# EAGLE board pandashield12-lga (EAGLE 6.0), part 1 of 2
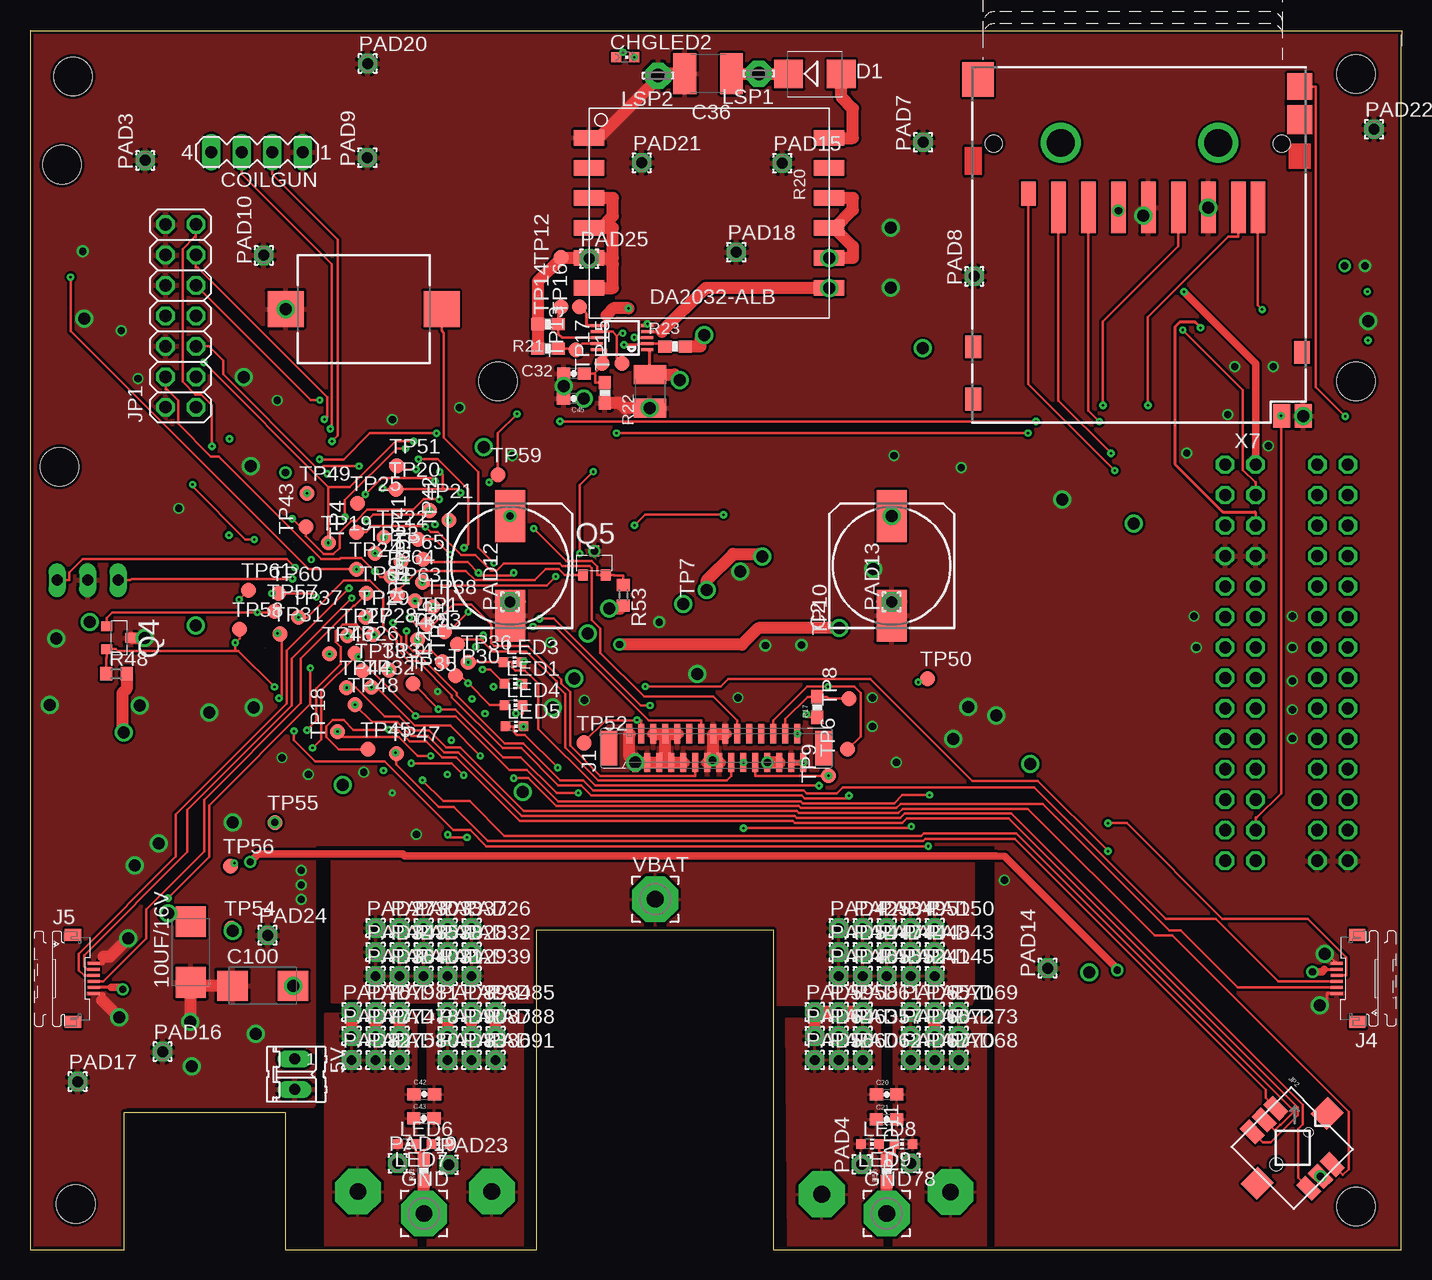
[diagram p9: board, top side]
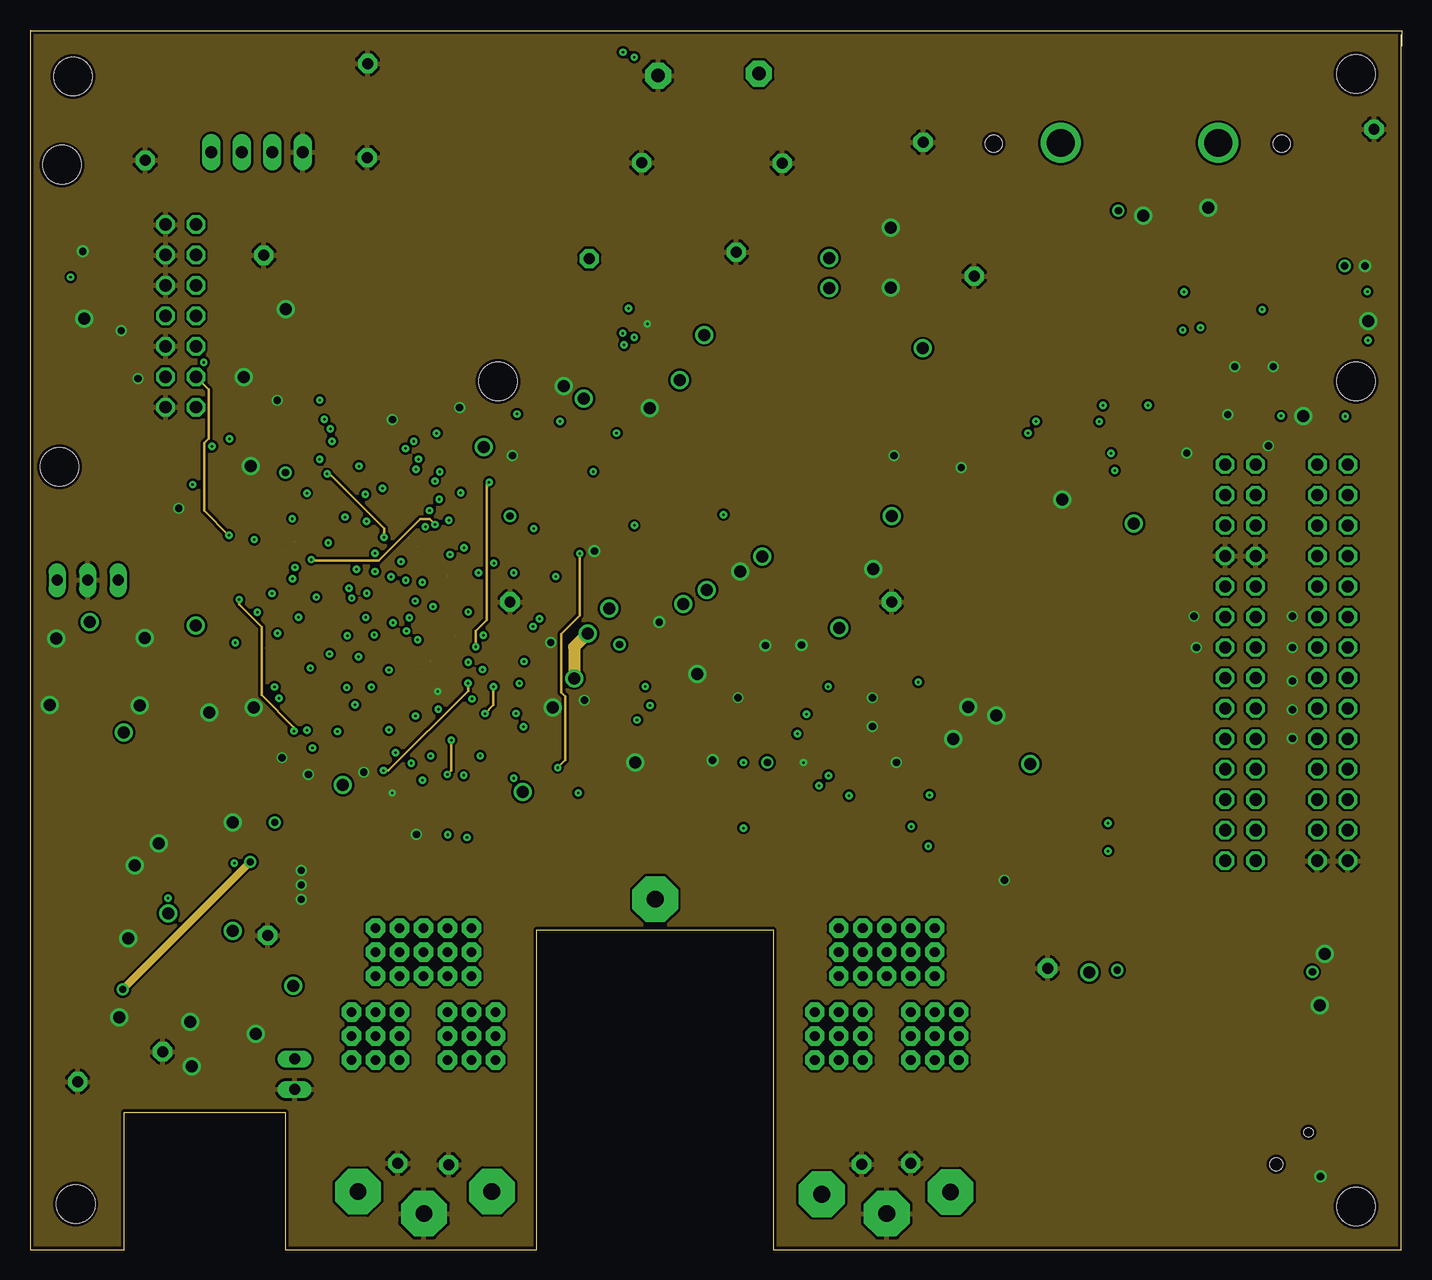
[diagram p10: board, inner layer Route2]
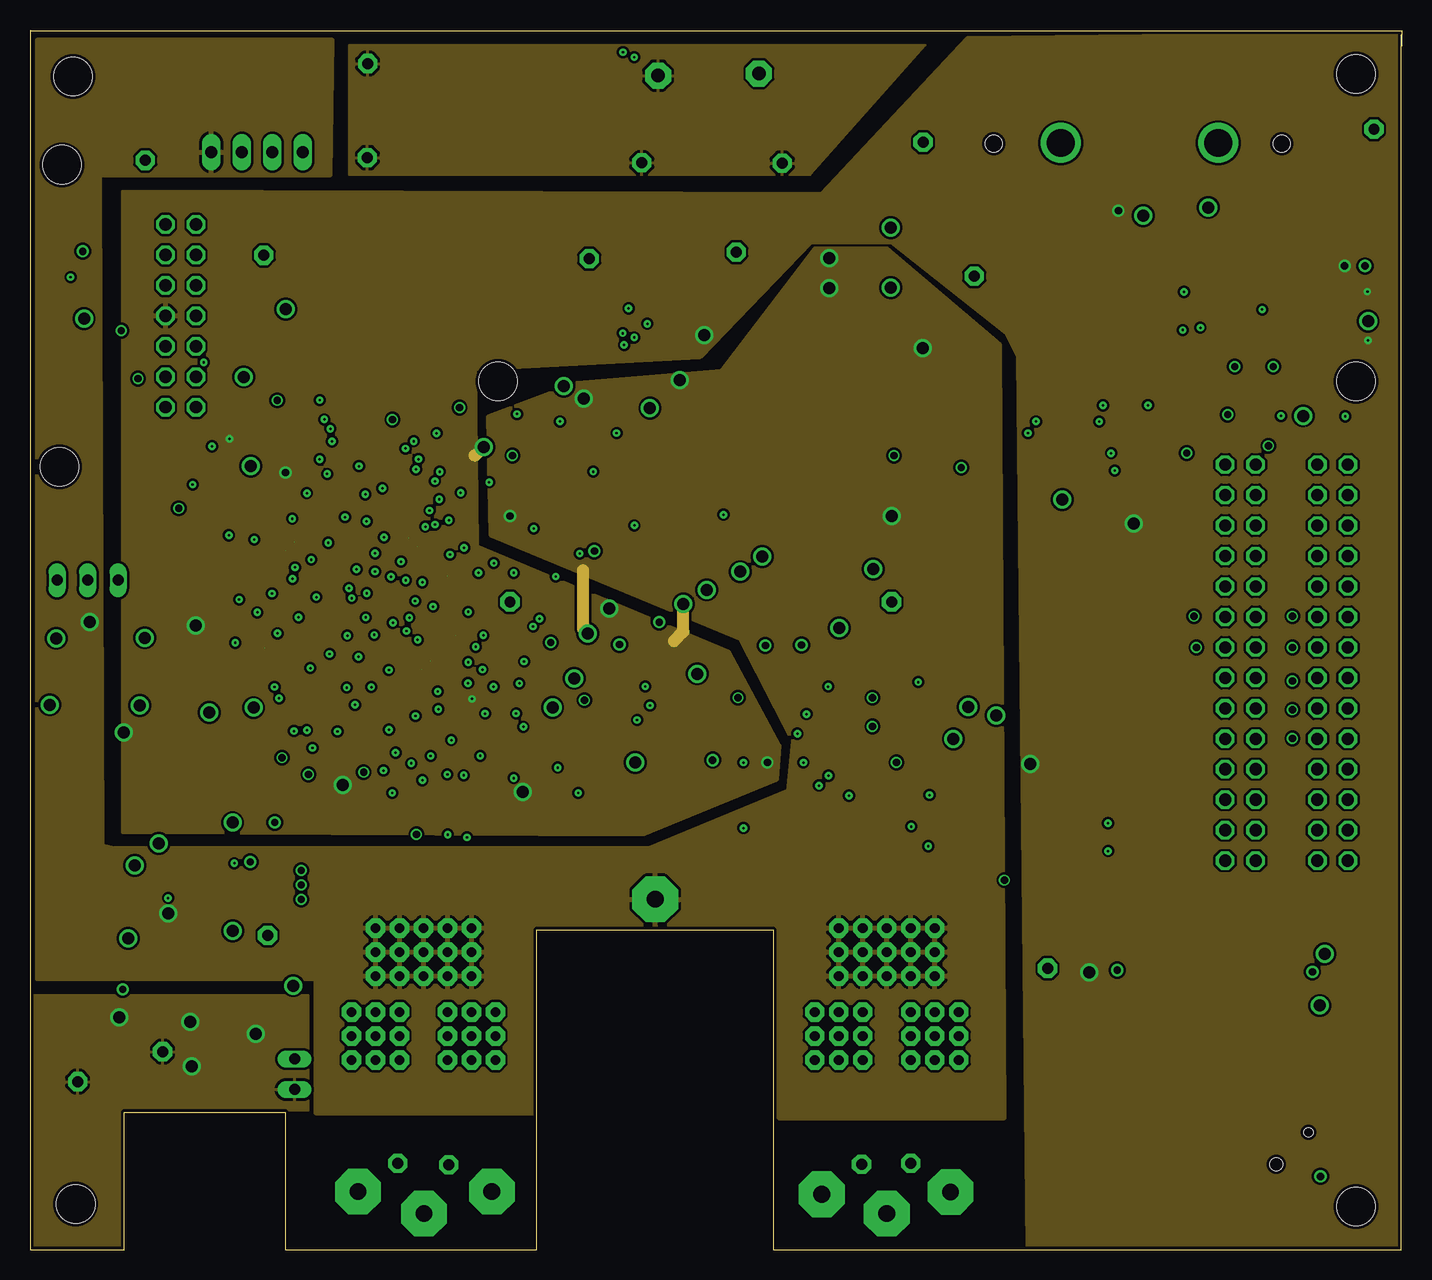
[diagram p11: board, inner layer Route15]
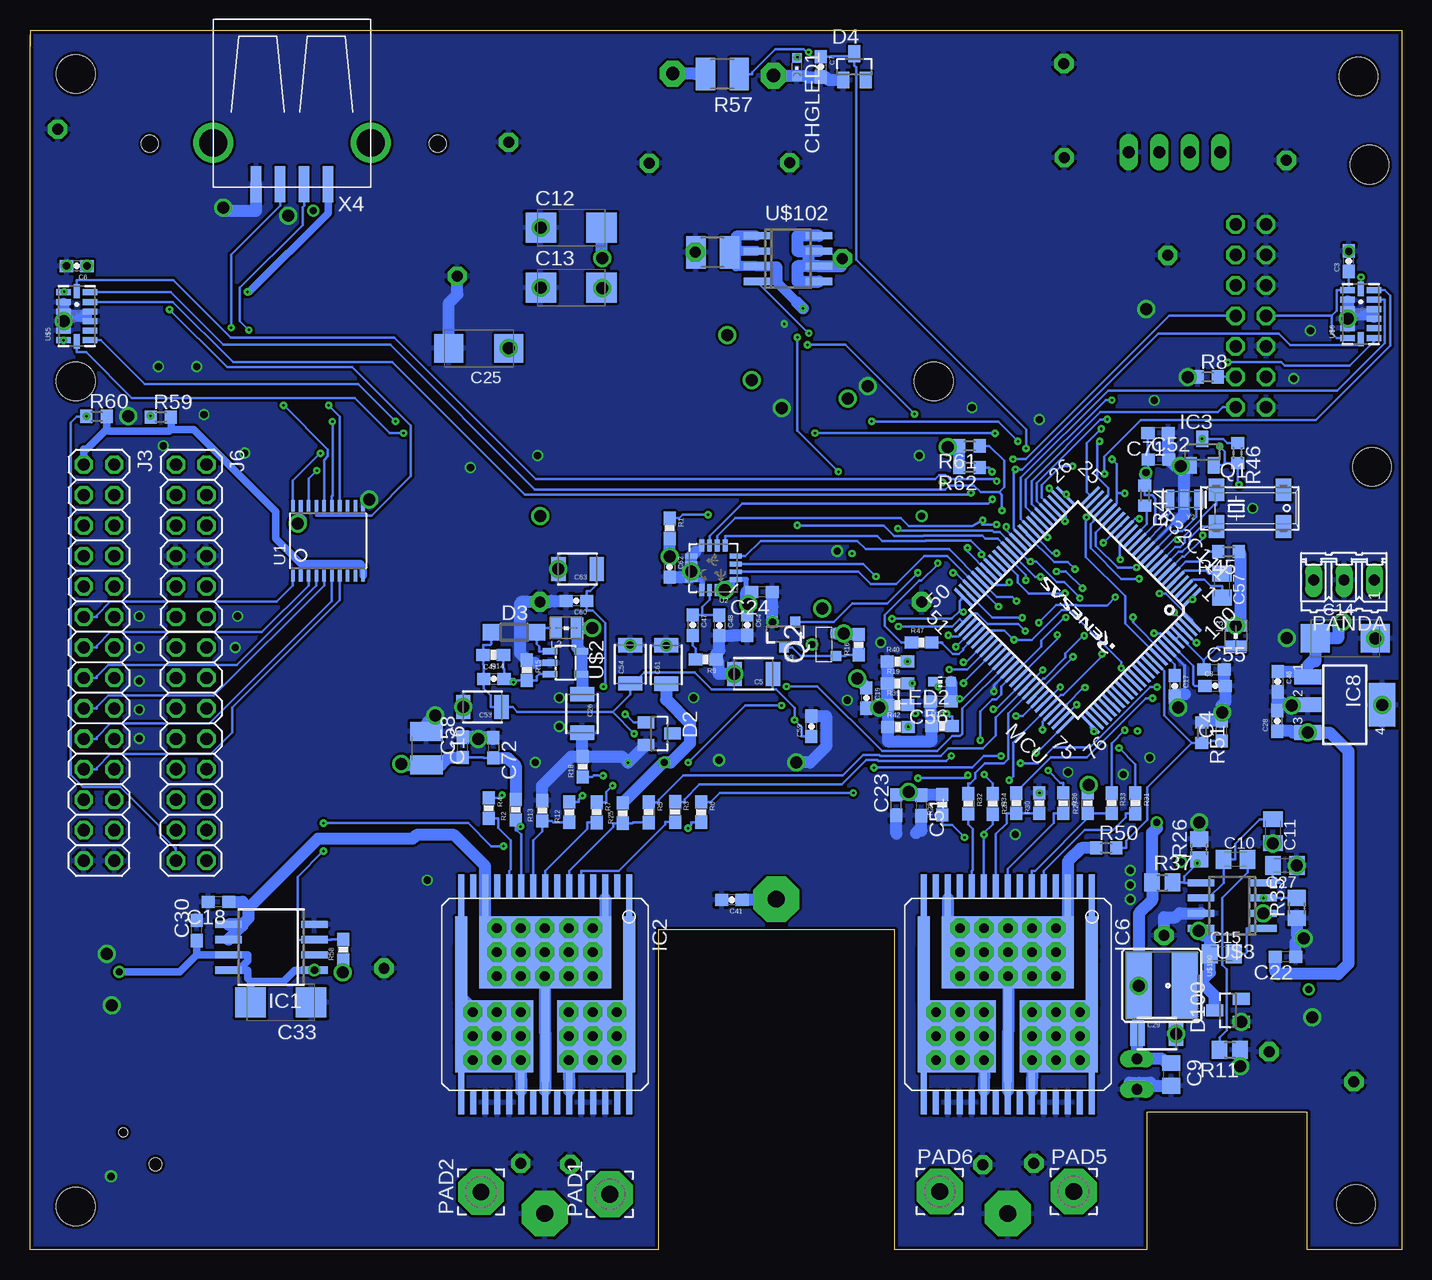
[diagram p12: board, bottom side, seen from below]

Size 114.3 x 101.67 mm. Coordinates in mm from the lower left corner, seen from the top.
Outline: 114.28,101.27 114.28,0 80.6,0 80.4,0 79.6,0 61.94,0 61.94,26.67 42.22,26.67 42.22,0 24.4,0 24.2,0 21.25,0 21.25,11.43 7.85,11.43 7.85,0 0,0 0,101.6
Outline: 0,101.67 0,101.6
Outline: 0,101.6 74.6,101.6 114.3,101.6 114.3,100.33
Copper layers (1*2+15*16): Top 0.035mm / dielectric 1.5mm / Route2 0.035mm / dielectric 0.15mm / Route15 0.035mm / dielectric 0.2mm / Bottom 0.035mm
Design rules: minimum track width 6mil, minimum drill 12mil, track to track 6mil, track to pad 6mil, pad to pad 6mil, via to via 6mil, smd to smd 0mil, copper to edge 10mil, drill to drill 10mil, minimum pad ring 10mil, minimum via ring 6mil, stop-mask expansion 2mil, vias tented up to drill 100mil, thermal gap 10mil
Net classes: 0 default: width 0.203 mm, drill 0.152 mm, clearance 0.203 mm; 1 power: width 0.635 mm, drill 0.305 mm, clearance 0.203 mm; 2 morepower: width 1.016 mm, drill 0.508 mm, clearance 0.203 mm
Holes 3.2 mm at 3.81,3.81 110.49,3.59 110.49,98.01 3.59,97.79 110.49,72.39 38.99,72.39 2.45,65.26 2.67,90.44

## Footprints (pad centres in the part's own frame; a part is rotated, then mirrored left to right if it is on the bottom)
02P = drill 0.914 long: 1 -1.27,0; 2 1.27,0
C/6032-28R = smd 2.55 x 2.5: + 2.525,0; - -2.525,0
153CLV-1014 = smd 4.3 x 2.5: + 4.15,0; - -4.15,0
0603-CAP = smd 1.1 x 1: 1 -0.85,0; 2 0.85,0
C0603 = smd 1.1 x 1: 1 -0.85,0; 2 0.85,0
1210 = smd 1.2 x 2: 1 -1.6,0; 2 1.6,0
C0805 = smd 1.3 x 1.5: 1 -0.95,0; 2 0.95,0
C0805K = smd 1.3 x 1.6: 1 -1,0; 2 1,0
SMC_C = smd 2.4 x 2.4: + -2.5,0; - 2.5,0
C1210 = smd 1.6 x 2.7: 1 -1.4,0; 2 1.4,0
C1812 = smd 1.9 x 3.4: 1 -1.95,0; 2 1.95,0
CHIPLED_0603 = smd 0.8 x 0.8: A 0,-0.75; C 0,0.75
MA04-1 = drill 1.016 long: 1 -3.81,0; 2 -1.27,0; 3 1.27,0; 4 3.81,0
SMB = smd 2.4 x 2.4: A 2.2,0; C -2.2,0
SOT23 = smd 1 x 1.4: 1 -0.95,-1.1; 2 0.95,-1.1; 3 0,1.1
SOD123 = smd 1.4 x 1.4: A 1.9,0; C -1.9,0
3,81/1,4 = drill 1.397 pad 3.81 octagon: 1 0,0
SOP-08 = smd 0.6 x 2.2: 1 -1.905,-3.6; 2 -0.635,-3.6; 3 0.635,-3.6; 4 1.905,-3.6; 5 1.905,3.575; 6 0.635,3.575; 7 -0.635,3.575; 8 -1.905,3.575
MULTIPOWERSO-30 = smd 0.508 x 12: 1 -7,-4; 15 7,-4; 16 7,4; 30 -7,4 | smd 0.508 x 2: 2 -6,-9; 4 -4,-9; 5 -3,-9; 6 -2,-9; 7 -1,-9; 8 0,-9; 9 1,-9; 10 2,-9; 11 3,-9; 12 4,-9; 14 6,-9; 17 6,9; 18 5,9; 19 4,9; 20 3,9; 22 1,9; 24 -1,9; 26 -3,9; 27 -4,9; 28 -5,9; 29 -6,9 | smd 0.508 x 4: 3 -5,-8; 13 5,-8; 21 2,8; 23 0,8; 25 -2,8 | smd 6.5 x 6: OUTA -4.25,3.5; OUTB 4.25,3.5 | smd 1 x 7.5: OUTA@1 -7,-2.755; OUTB@1 7,-2.755 | smd 11 x 6: VCC 0,-3.5 | smd 0.65 x 8.3: VCC@1 0,3.145
SOT23B-3 = smd 1 x 1.4: 1 -0.95,-1.1; 2 0.95,-1.1; 3 0,1.1
SOT223 = smd 1.219 x 2.235: 1 -2.311,-3.099; 2 0,-3.099; 3 2.311,-3.099 | smd 3.6 x 2.2: 4 0,3.099
XF2J-3024-11 = smd 1.6 x 0.5: 1 1.2,7.25; 2 -1.2,6.75; 3 1.2,6.25; 4 -1.2,5.75; 5 1.2,5.25; 6 -1.2,4.75; 7 1.2,4.25; 8 -1.2,3.75; 9 1.2,3.25; 10 -1.2,2.75; 11 1.2,2.25; 12 -1.2,1.75; 13 1.2,1.25; 14 -1.2,0.75; 15 1.2,0.25; 16 -1.2,-0.25; 17 1.2,-0.75; 18 -1.2,-1.25; 19 1.2,-1.75; 20 -1.2,-2.25; 21 1.2,-2.75; 22 -1.2,-3.25; 23 1.2,-3.75; 24 -1.2,-4.25; 25 1.2,-4.75; 26 -1.2,-5.25; 27 1.2,-5.75; 28 -1.2,-6.25; 29 1.2,-6.75; 30 -1.2,-7.25 | smd 2.9 x 1.4: M1 0,8.95; M2 0,-8.95
2X14 = drill 1.016 octagon: 1 -16.51,-1.27; 2 -16.51,1.27; 3 -13.97,-1.27; 4 -13.97,1.27; 5 -11.43,-1.27; 6 -11.43,1.27; 7 -8.89,-1.27; 8 -8.89,1.27; 9 -6.35,-1.27; 10 -6.35,1.27; 11 -3.81,-1.27; 12 -3.81,1.27; 13 -1.27,-1.27; 14 -1.27,1.27; 15 1.27,-1.27; 16 1.27,1.27; 17 3.81,-1.27; 18 3.81,1.27; 19 6.35,-1.27; 20 6.35,1.27; 21 8.89,-1.27; 22 8.89,1.27; 23 11.43,-1.27; 24 11.43,1.27; 25 13.97,-1.27; 26 13.97,1.27; 27 16.51,-1.27; 28 16.51,1.27
XF2L-0625-1 = smd 1 x 0.25: 1 1.905,1.25; 2 1.905,0.75; 3 1.905,0.25; 4 1.905,-0.25; 5 1.905,-0.75; 6 1.905,-1.25 | smd 1.34 x 1: M1 0.18,3.638; M2 0.18,-3.638
2X07 = drill 1.016 octagon: 1 -7.62,-1.27; 2 -7.62,1.27; 3 -5.08,-1.27; 4 -5.08,1.27; 5 -2.54,-1.27; 6 -2.54,1.27; 7 0,-1.27; 8 0,1.27; 9 2.54,-1.27; 10 2.54,1.27; 11 5.08,-1.27; 12 5.08,1.27; 13 7.62,-1.27; 14 7.62,1.27
JOYSTICK_MINI = smd 1.85 x 1.1: A 0,2.8; B 6.65,2.8; C 0,0; CTR 0,1.4; D 6.65,0; GND 6.65,1.4 | smd 1.9 x 2: NC 3.325,5.53; NC@0 3.33,-2.72 | hole 0.75: 3.34,3.295 | hole 1.05: 3.325,-0.5
WE-KI_0805_B = smd 1.02 x 1.78: 1 -0.89,0; 2 0.89,0
CHIP-LED0603 = smd 0.8 x 0.8: A 0,-0.75; C 0,0.75
LSP11 = drill 1.118 pad 2.159 octagon: MP 0,0
MSOP = smd 0.25 x 1: 1 -1,-2.113; 2 -0.5,-2.113; 3 0,-2.113; 4 0.5,-2.113; 5 1,-2.113; 6 1,2.113; 7 0.5,2.113; 8 0,2.113; 9 -0.5,2.113; 10 -1,2.113
100P6Q-A = smd 0.25 x 2: 1 -6,-7.5; 2 -5.5,-7.5; 3 -5,-7.5; 4 -4.5,-7.5; 5 -4,-7.5; 6 -3.5,-7.5; 7 -3,-7.5; 8 -2.5,-7.5; 9 -2,-7.5; 10 -1.5,-7.5; 11 -1,-7.5; 12 -0.5,-7.5; 13 0,-7.5; 14 0.5,-7.5; 15 1,-7.5; 16 1.5,-7.5; 17 2,-7.5; 18 2.5,-7.5; 19 3,-7.5; 20 3.5,-7.5; 21 4,-7.5; 22 4.5,-7.5; 23 5,-7.5; 24 5.5,-7.5; 25 6,-7.5; 51 6,7.5; 52 5.5,7.5; 53 5,7.5; 54 4.5,7.5; 55 4,7.5; 56 3.5,7.5; 57 3,7.5; 58 2.5,7.5; 59 2,7.5; 60 1.5,7.5; 61 1,7.5; 62 0.5,7.5; 63 0,7.5; 64 -0.5,7.5; 65 -1,7.5; 66 -1.5,7.5; 67 -2,7.5; 68 -2.5,7.5; 69 -3,7.5; 70 -3.5,7.5; 71 -4,7.5; 72 -4.5,7.5; 73 -5,7.5; 74 -5.5,7.5; 75 -6,7.5 | smd 2 x 0.25: 26 7.5,-6; 27 7.5,-5.5; 28 7.5,-5; 29 7.5,-4.5; 30 7.5,-4; 31 7.5,-3.5; 32 7.5,-3; 33 7.5,-2.5; 34 7.5,-2; 35 7.5,-1.5; 36 7.5,-1; 37 7.5,-0.5; 38 7.5,0; 39 7.5,0.5; 40 7.5,1; 41 7.5,1.5; 42 7.5,2; 43 7.5,2.5; 44 7.5,3; 45 7.5,3.5; 46 7.5,4; 47 7.5,4.5; 48 7.5,5; 49 7.5,5.5; 50 7.5,6; 76 -7.5,6; 77 -7.5,5.5; 78 -7.5,5; 79 -7.5,4.5; 80 -7.5,4; 81 -7.5,3.5; 82 -7.5,3; 83 -7.5,2.5; 84 -7.5,2; 85 -7.5,1.5; 86 -7.5,1; 87 -7.5,0.5; 88 -7.5,0; 89 -7.5,-0.5; 90 -7.5,-1; 91 -7.5,-1.5; 92 -7.5,-2; 93 -7.5,-2.5; 94 -7.5,-3; 95 -7.5,-3.5; 96 -7.5,-4; 97 -7.5,-4.5; 98 -7.5,-5; 99 -7.5,-5.5; 100 -7.5,-6
1,6/0,9 = drill 0.914 pad 1.6 octagon: 1 0,0
1,6/0,8 = drill 0.813 pad 1.6 octagon: 1 0,0
03P = drill 0.914 long: 1 -2.54,0; 2 0,0; 3 2.54,0
MM20SS = smd 1.27 x 1.88: 1 -2.794,-1.524; 2 2.794,-1.524; 3 2.794,1.524; 4 -2.794,1.524
MICRO3 = smd 0.8 x 0.9: 1 -0.95,-1; 2 0.95,-1; 3 0,1
SOT23-3 = smd 0.8 x 0.9: 1 -0.95,-1; 2 0.95,-1; 3 0,1.1
0603-RES = smd 1.1 x 1: 1 -0.85,0; 2 0.85,0
R0603 = smd 1 x 1.1: 1 -0.85,0; 2 0.85,0
R0805 = smd 1.3 x 1.5: 1 -0.85,0; 2 0.85,0
R1210 = smd 1.6 x 2.7: 1 -1.4,0; 2 1.4,0
BUZZER-CMT1102 = smd 3 x 3: 1 -6.5,0; 2 6.5,0
B1,27 = smd 1.27 x 1.27: TP 0,0
TSSOP20 = smd 0.305 x 0.991: 1 -2.925,-2.918; 2 -2.275,-2.918; 3 -1.625,-2.918; 4 -0.975,-2.918; 5 -0.325,-2.918; 6 0.325,-2.918; 7 0.975,-2.918; 8 1.625,-2.918; 9 2.275,-2.918; 10 2.925,-2.918; 11 2.925,2.918; 12 2.275,2.918; 13 1.625,2.918; 14 0.975,2.918; 15 0.325,2.918; 16 -0.325,2.918; 17 -0.975,2.918; 18 -1.625,2.918; 19 -2.275,2.918; 20 -2.925,2.918
LGA16-4X4 = smd 1 x 0.4: 1 -1.85,0.975; 2 -1.85,0.325; 3 -1.85,-0.325; 4 -1.85,-0.975; 9 1.85,-0.975; 10 1.85,-0.325; 11 1.85,0.325; 12 1.85,0.975 | smd 0.4 x 1: 5 -0.975,-1.85; 6 -0.325,-1.85; 7 0.325,-1.85; 8 0.975,-1.85; 13 0.975,1.85; 14 0.325,1.85; 15 -0.325,1.85; 16 -0.975,1.85
DA2032-ALB = smd 2.54 x 1.27: 1 -10,6.27; 2 -10,3.77; 3 -10,1.27; 4 -10,-1.23; 5 -10,-3.73; 6 -10,-6.23; 7 10,-6.23; 8 10,-3.73; 9 10,-1.23; 10 10,1.27; 11 10,3.77; 12 10,6.27
SOT23-DBV = smd 0.55 x 1.2: 1 -0.95,-1.3; 2 0,-1.3; 3 0.95,-1.3; 4 0.95,1.3; 5 -0.95,1.3
SO8 = smd 0.6 x 2.2: 1 -1.905,-2.6; 2 -0.635,-2.6; 3 0.635,-2.6; 4 1.905,-2.6; 5 1.905,2.6; 6 0.635,2.6; 7 -0.635,2.6; 8 -1.905,2.6
LGA14 = smd 0.5 x 1.2: 1 2,1.1; 2 1.2,1.1; 3 0.4,1.1; 4 -0.4,1.1; 5 -1.2,1.1; 6 -2,1.1; 8 -2,-1.1; 9 -1.2,-1.1; 10 -0.4,-1.1; 11 0.4,-1.1; 12 1.2,-1.1; 13 2,-1.1 | smd 1.2 x 0.5: 7 -2.1,0; 14 2.1,0
CR54 = smd 5.5 x 2.15: P$1 0,1.92; P$2 0,-1.92
USB-A-S = smd 3 x 0.9: D+ 3.45,-1; D- 3.45,1; GND 3.45,-3; VBUS 3.45,3 | drill 2.311: P$5 0,-6.566; P$6 0,6.566
SDBMF-009XXBXX2 = smd 1.2 x 4.3: 1 6.7,5.325; 2 4.2,5.325; 3 1.7,5.325; 4 -0.8,5.325; 5 -3.3,5.325; 6 -5.8,5.325; 7 -8.3,5.325; 8 -9.925,5.325 | smd 1.2 x 2: 9 9.2,4.175 | smd 2.1 x 2.4: M1 -13.4,-2 | smd 2.6 x 2.9: M2 13.4,-5.35 | smd 1.3 x 1.9: M3 -13.6,17.4; M4 13.8,16.95; M5 13.8,21.3 | smd 1.4 x 1.95: SW1 -11.9,22.7; SW3 -13.7,22.7 | smd 2.1 x 2.2: SW2 -13.4,-4.75 | hole 1.4: -11.9,0; 12.1,0
RESONATOR-SMD = smd 0.7 x 1.7: 1 -1.2,0; 2 0,0; 3 1.2,0

## Placement (x,y rotation side)
5V  [02P]  22.05,14.61 270 top
10UF/16V  [C/6032-28R]  13.4,24.8 90 top
C1  820uF/16V  [153CLV-1014]  40,57 90 top
C2  820uF/16V  [153CLV-1014]  71.8,57 90 top
C3  0.1  [0603-CAP]  4.4,82.4 90 bottom
C4  33nF  [C0603]  15.01,43.24 90 bottom
C5  10uF  [1210]  54,48 180 bottom
C6  0.1  [0603-CAP]  110.4,82 180 bottom
C7  33n  [0603-CAP]  48.4,98.6 270 bottom
C8  33nF  [0603-CAP]  15.54,47 0 bottom
C9  4,7uF/6.3V  [C0805]  19.2,14.6 270 bottom
C10  180pF  [C0805K]  13.83,32.53 0 bottom
C11  12pF  [C0805K]  10.72,34.87 270 bottom
C12  100uF/16V  [C/6032-28R]  69.2,85.2 0 bottom
C13  100uF/16V  [C/6032-28R]  69.2,80.2 0 bottom
C14  22,0  [SMC_C]  4.69,50.96 0 bottom
C15  0.1  [C0805K]  14.99,24.66 0 bottom
C16  10,0  [C1210]  81.26,41.79 270 bottom
C17  33nF  [0603-CAP]  18.9,47 270 bottom
C18  0.1  [C0603]  98.6,29 180 bottom
C19  0,1  [0603-CAP]  44.6,45.98 270 bottom
C20  0,1  [0603-CAP]  71.38,12.93 0 top
C21  0,22  [0603-CAP]  71.38,10.86 0 top
C22  0,1  [C0603]  9.68,24.4 180 bottom
C23  0,1  [C0603]  42.1,37.06 90 bottom
C24  10n  [C0603]  53.3,54.83 180 bottom
C25  22,0  [SMC_C]  76.9,75.13 180 bottom
C26  10,0  [1210]  68.3,44.68 270 bottom
C27  15nF  [C0805K]  9.73,32.03 180 bottom
C28  0.1  [0603-CAP]  10.36,44.07 90 bottom
C29  10uF/6.3V  [1210]  20.4,18 0 bottom
C30  0.1  [C0603]  100.4,26.6 90 bottom
C31  10u  [C1210]  51.67,71.54 270 top
C32  100p  [0603-CAP]  45.33,73.02 180 top
C33  10uF/6.3V  [C/6032-28R]  93.4,20.6 180 bottom
C36  0.1uF 600V  [C1812]  56.52,98.03 180 top
C41  0,1  [0603-CAP]  55.81,29.15 180 bottom
C42  0,1  [0603-CAP]  32.85,12.96 0 top
C43  0,22  [0603-CAP]  32.82,10.93 0 top
C45  0.1  [0603-CAP]  45.32,70.94 180 top
C46  1uF  [0603-CAP]  10.32,47.35 270 bottom
C47  470nF  [0603-CAP]  59.07,52.05 270 bottom
C48  10nF  [0603-CAP]  56.85,52.04 270 bottom
C49  100p  [0603-CAP]  75.65,47.58 0 bottom
C51  0,1  [C0603]  40.03,37.03 270 bottom
C52  0,1  [C0603]  20.26,65.87 0 bottom
C53  10uF  [1210]  76.59,45.24 180 bottom
C54  10uF  [1210]  64.29,48.79 90 bottom
C55  0,1  [C0603]  15.62,48.35 0 bottom
C56  0,1  [C0603]  38.41,45.71 180 bottom
C57  4,7uF  [C0805K]  14.96,55.36 270 bottom
C58  0,1  [C0603]  78.23,41.86 90 bottom
C59  0.1  [0603-CAP]  49.18,43.62 90 bottom
C60  0.1  [0603-CAP]  68.76,54.08 180 bottom
C61  10uF  [1210]  61.28,48.76 90 bottom
C62  0.1  [0603-CAP]  61.01,56.91 270 bottom
C63  10uF  [1210]  68.67,56.73 180 bottom
C64  0.1  [0603-CAP]  54.52,52.07 270 bottom
C71  0,1  [C0603]  20.29,68.06 180 bottom
C72  0,1  [C0603]  75.68,41.82 270 bottom
C100  47uF/16V  [C/6032-28R]  19.4,22 0 top
CHGLED1  [CHIPLED_0603]  50.4,98.6 180 bottom
CHGLED2  [CHIPLED_0603]  49.6,99.4 270 top
COILGUN  [MA04-1]  18.92,91.49 180 top
D1  MURS160  [SMB]  65.41,98.01 0 top
D2  BAS70-04  [SOT23]  61.87,43.01 270 bottom
D3  MBR0530  [SOD123]  73.96,51.47 0 bottom
D4  BAT54  [SOT23]  45.6,98.6 0 bottom
D100  BAT54  [SOT23]  14.47,19.94 90 bottom
GND  [3,81/1,4]  32.83,3 0 top
GND78  [3,81/1,4]  71.4,3 0 top
IC1  TPS77350  [SOP-08]  94.2,25.2 90 bottom
IC2  VNH2SP30TR-E  [MULTIPOWERSO-30]  71.37,21.26 180 bottom
IC3  MAX803T  [SOT23B-3]  16.62,66.48 0 bottom
IC6  VNH2SP30TR-E  [MULTIPOWERSO-30]  32.81,21.27 180 bottom
IC8  LM2936MP-3.3  [SOT223]  4.73,45.42 270 bottom
J1  XF2J-3024-11  [XF2J-3024-11]  57.2,41.8 90 top
J3  [2X14]  108.55,48.93 270 bottom
J4  XF2L-0625-1  [XF2L-0625-1]  110.8,22.6 180 top
J5  XF2L-0625-1  [XF2L-0625-1]  3.4,22.6 0 top
J6  [2X14]  100.86,48.93 270 bottom
JP1  [2X07]  12.56,77.84 90 top
JP2  JOYSTICK_MINI4UCON  [JOYSTICK_MINI]  101.85,9.81 315 top
L2  10uH  [WE-KI_0805_B]  69.6,51.8 0 bottom
L3  4,7uH  [WE-KI_0805_B]  13.82,51.14 270 bottom
LED1  [CHIP-LED0603]  40.29,47.18 270 top
LED2  [CHIP-LED0603]  38.3,47.33 90 bottom
LED3  [CHIP-LED0603]  40.22,48.98 270 top
LED4  [CHIP-LED0603]  40.3,45.39 270 top
LED5  [CHIP-LED0603]  40.36,43.62 270 top
LED6  [CHIP-LED0603]  31.4,8.8 270 top
LED7  [CHIP-LED0603]  34.2,8.8 90 top
LED8  [CHIP-LED0603]  70,8.8 270 top
LED9  [CHIP-LED0603]  72.8,8.8 90 top
LSP1  LSP11  [LSP11]  60.74,98.03 180 top
LSP2  LSP11  [LSP11]  52.34,97.86 180 top
LT3750  LT3750  [MSOP]  49.33,76.01 90 top
MCU  R32C111  [100P6Q-A]  26.98,53.32 135 bottom
PAD1  [3,81/1,4]  65.99,4.61 90 bottom
PAD2  [3,81/1,4]  76.72,4.8 90 bottom
PAD3  [1,6/0,9]  9.6,90.8 90 top
PAD4  [1,6/0,9]  69.3,7.12 90 top
PAD5  [3,81/1,4]  27.33,4.83 0 bottom
PAD6  [3,81/1,4]  38.49,4.83 0 bottom
PAD7  [1,6/0,9]  74.42,92.31 90 top
PAD8  [1,6/0,9]  78.69,81.14 90 top
PAD9  [1,6/0,9]  28.12,91.03 90 top
PAD10  [1,6/0,9]  19.49,82.89 90 top
PAD11  [1,6/0,9]  73.4,7.2 90 top
PAD12  [1,6/0,9]  40,54 90 top
PAD13  [1,6/0,9]  71.8,54 90 top
PAD14  [1,6/0,9]  84.8,23.46 90 top
PAD15  [1,6/0,9]  62.68,90.57 0 top
PAD16  [1,6/0,9]  11.05,16.5 0 top
PAD17  [1,6/0,9]  3.97,14 0 top
PAD18  [1,6/0,9]  58.86,83.15 0 top
PAD19  [1,6/0,9]  30.64,7.19 0 top
PAD20  [1,6/0,9]  28.13,98.88 0 top
PAD21  [1,6/0,9]  50.98,90.6 0 top
PAD22  [1,6/0,9]  112,93.4 0 top
PAD23  [1,6/0,9]  34.9,7.06 0 top
PAD24  [1,6/0,9]  19.8,26.2 0 top
PAD25  [1,6/0,9]  46.6,82.6 0 top
PAD26  WIREPAD1,6/0,8  [1,6/0,8]  36.8,26.8 0 top
PAD27  WIREPAD1,6/0,8  [1,6/0,8]  28.8,26.8 0 top
PAD28  WIREPAD1,6/0,8  [1,6/0,8]  34.8,24.8 0 top
PAD29  WIREPAD1,6/0,8  [1,6/0,8]  34.8,22.8 0 top
PAD30  WIREPAD1,6/0,8  [1,6/0,8]  30.8,26.8 0 top
PAD31  WIREPAD1,6/0,8  [1,6/0,8]  32.8,22.8 0 top
PAD32  WIREPAD1,6/0,8  [1,6/0,8]  36.8,24.8 0 top
PAD33  WIREPAD1,6/0,8  [1,6/0,8]  32.8,26.8 0 top
PAD34  WIREPAD1,6/0,8  [1,6/0,8]  28.8,24.8 0 top
PAD35  WIREPAD1,6/0,8  [1,6/0,8]  30.8,24.8 0 top
PAD36  WIREPAD1,6/0,8  [1,6/0,8]  28.8,22.8 0 top
PAD37  WIREPAD1,6/0,8  [1,6/0,8]  34.8,26.8 0 top
PAD38  WIREPAD1,6/0,8  [1,6/0,8]  32.8,24.8 0 top
PAD39  WIREPAD1,6/0,8  [1,6/0,8]  36.8,22.8 0 top
PAD40  WIREPAD1,6/0,8  [1,6/0,8]  30.8,22.8 0 top
PAD41  WIREPAD1,6/0,8  [1,6/0,8]  73.4,22.8 0 top
PAD42  WIREPAD1,6/0,8  [1,6/0,8]  67.4,26.8 0 top
PAD43  WIREPAD1,6/0,8  [1,6/0,8]  75.4,24.8 0 top
PAD44  WIREPAD1,6/0,8  [1,6/0,8]  71.4,24.8 0 top
PAD45  WIREPAD1,6/0,8  [1,6/0,8]  75.4,22.8 0 top
PAD46  WIREPAD1,6/0,8  [1,6/0,8]  67.4,22.8 0 top
PAD47  WIREPAD1,6/0,8  [1,6/0,8]  69.4,24.8 0 top
PAD48  WIREPAD1,6/0,8  [1,6/0,8]  73.4,24.8 0 top
PAD49  WIREPAD1,6/0,8  [1,6/0,8]  71.4,26.8 0 top
PAD50  WIREPAD1,6/0,8  [1,6/0,8]  75.4,26.8 0 top
PAD51  WIREPAD1,6/0,8  [1,6/0,8]  73.4,26.8 0 top
PAD52  WIREPAD1,6/0,8  [1,6/0,8]  71.4,22.8 0 top
PAD53  WIREPAD1,6/0,8  [1,6/0,8]  69.4,26.8 0 top
PAD54  WIREPAD1,6/0,8  [1,6/0,8]  67.4,24.8 0 top
PAD55  WIREPAD1,6/0,8  [1,6/0,8]  69.4,22.8 0 top
PAD56  WIREPAD1,6/0,8  [1,6/0,8]  65.4,15.8 0 top
PAD57  WIREPAD1,6/0,8  [1,6/0,8]  69.4,17.8 0 top
PAD58  WIREPAD1,6/0,8  [1,6/0,8]  67.4,19.8 0 top
PAD59  WIREPAD1,6/0,8  [1,6/0,8]  65.4,19.8 0 top
PAD60  WIREPAD1,6/0,8  [1,6/0,8]  67.4,15.8 0 top
PAD61  WIREPAD1,6/0,8  [1,6/0,8]  69.4,19.8 0 top
PAD62  WIREPAD1,6/0,8  [1,6/0,8]  69.4,15.8 0 top
PAD63  WIREPAD1,6/0,8  [1,6/0,8]  67.4,17.8 0 top
PAD64  WIREPAD1,6/0,8  [1,6/0,8]  65.4,17.8 0 top
PAD65  WIREPAD1,6/0,8  [1,6/0,8]  73.4,19.8 0 top
PAD66  WIREPAD1,6/0,8  [1,6/0,8]  73.4,17.8 0 top
PAD67  WIREPAD1,6/0,8  [1,6/0,8]  73.4,15.8 0 top
PAD68  WIREPAD1,6/0,8  [1,6/0,8]  77.4,15.8 0 top
PAD69  WIREPAD1,6/0,8  [1,6/0,8]  77.4,19.8 0 top
PAD70  WIREPAD1,6/0,8  [1,6/0,8]  75.4,15.8 0 top
PAD71  WIREPAD1,6/0,8  [1,6/0,8]  75.4,19.8 0 top
PAD72  WIREPAD1,6/0,8  [1,6/0,8]  75.4,17.8 0 top
PAD73  WIREPAD1,6/0,8  [1,6/0,8]  77.4,17.8 0 top
PAD74  WIREPAD1,6/0,8  [1,6/0,8]  28.8,17.8 0 top
PAD75  WIREPAD1,6/0,8  [1,6/0,8]  28.8,15.8 0 top
PAD76  WIREPAD1,6/0,8  [1,6/0,8]  26.8,19.8 0 top
PAD77  WIREPAD1,6/0,8  [1,6/0,8]  26.8,17.8 0 top
PAD78  WIREPAD1,6/0,8  [1,6/0,8]  30.8,17.8 0 top
PAD79  WIREPAD1,6/0,8  [1,6/0,8]  28.8,19.8 0 top
PAD80  WIREPAD1,6/0,8  [1,6/0,8]  30.8,15.8 0 top
PAD81  WIREPAD1,6/0,8  [1,6/0,8]  30.8,19.8 0 top
PAD82  WIREPAD1,6/0,8  [1,6/0,8]  26.8,15.8 0 top
PAD83  WIREPAD1,6/0,8  [1,6/0,8]  34.8,15.8 0 top
PAD84  WIREPAD1,6/0,8  [1,6/0,8]  36.8,19.8 0 top
PAD85  WIREPAD1,6/0,8  [1,6/0,8]  38.8,19.8 0 top
PAD86  WIREPAD1,6/0,8  [1,6/0,8]  36.8,15.8 0 top
PAD87  WIREPAD1,6/0,8  [1,6/0,8]  36.8,17.8 0 top
PAD88  WIREPAD1,6/0,8  [1,6/0,8]  38.8,17.8 0 top
PAD89  WIREPAD1,6/0,8  [1,6/0,8]  34.8,19.8 0 top
PAD90  WIREPAD1,6/0,8  [1,6/0,8]  34.8,17.8 0 top
PAD91  WIREPAD1,6/0,8  [1,6/0,8]  38.8,15.8 0 top
PANDA  [03P]  4.8,55.8 180 bottom
Q1  [MM20SS]  12.64,61.8 0 bottom
Q2  IRLML6401  [MICRO3]  48.13,50.43 90 bottom
Q3  [SOT23-3]  51.48,51.31 180 bottom
Q4  IRLML6401  [MICRO3]  7.4,51 270 top
Q5  IRLML6401  [MICRO3]  47.03,57.23 0 top
R1  4k7  [0603-RES]  60.99,60.12 270 bottom
R2  3k3  [0603-RES]  73.83,36.66 90 bottom
R3  1k  [0603-RES]  60.55,36.48 270 bottom
R4  1k  [0603-RES]  76.07,36.79 270 bottom
R5  1k  [0603-RES]  62.72,36.44 270 bottom
R6  1k  [0603-RES]  58.38,36.48 270 bottom
R7  1k  [0603-RES]  67.08,36.44 270 bottom
R8  4k7  [R0603]  16.15,72.75 0 bottom
R9  10k  [0603-RES]  57.99,49.2 180 bottom
R10  1k  [0603-RES]  38.31,43.64 0 bottom
R11  63k4  [R0805]  14.31,16.63 180 bottom
R12  10k  [0603-RES]  69.36,36.47 90 bottom
R13  1k5  [0603-RES]  71.61,36.57 90 bottom
R14  117k  [0603-RES]  75.69,49.58 180 bottom
R15  13k3  [0603-RES]  72.89,48.29 270 bottom
R16  10k  [0603-RES]  45.23,50.43 90 bottom
R17  51r  [0603-RES]  65.6,45.23 90 top
R18  680k  [0603-RES]  68.23,40.25 90 bottom
R19  1k  [0603-RES]  42,47.2 0 bottom
R20  8m  [R1210]  57.41,83.13 180 bottom
R21  43k  [0603-RES]  43.18,77.13 180 top
R22  1.87k  [0603-RES]  47.91,71.43 270 top
R23  10k  [0603-RES]  53.76,75.29 180 top
R24  60.4k  [0603-RES]  43.17,75.1 180 top
R25  3k3  [0603-RES]  64.91,36.39 90 bottom
R26  1k87  [R0805]  16.87,33.38 90 bottom
R27  3k3  [0603-RES]  26.16,37.21 90 bottom
R28  3k3  [0603-RES]  38.28,37.09 90 bottom
R29  10k  [0603-RES]  32.1,37.2 90 bottom
R30  1k5  [0603-RES]  30.19,37.22 90 bottom
R31  1k  [0603-RES]  22.18,37.19 270 bottom
R32  1k  [0603-RES]  36.1,37.16 270 bottom
R33  1k  [0603-RES]  24.16,37.2 270 bottom
R34  1k  [0603-RES]  34.07,37.15 270 bottom
R35  100k  [R0805]  8.72,28.47 90 bottom
R36  1k  [0603-RES]  28.18,37.2 270 bottom
R37  10k  [R0805]  19.94,30.59 0 bottom
R39  1k  [0603-RES]  42,45.4 0 bottom
R40  1k  [0603-RES]  42.02,49.02 0 bottom
R41  1k  [0603-RES]  32.8,6.6 90 top
R42  1k  [0603-RES]  41.96,43.58 0 bottom
R44  4k7  [R0603]  21.39,62.85 270 bottom
R45  4k7  [R0603]  14.41,58.18 180 bottom
R46  4k7  [R0603]  13.66,66.4 270 bottom
R47  1k  [0603-RES]  40,50.6 0 bottom
R48  4k7  [R0603]  7.2,48 0 top
R50  4k7  [R0603]  24.61,33.48 0 bottom
R51  1k5  [R0603]  16.65,43.09 270 bottom
R53  4k7  [R0603]  49.44,54.55 270 top
R56  1k  [0603-RES]  71.4,6.54 90 top
R57  400k  [R1210]  56.6,98 180 bottom
R58  10k  [0603-RES]  88.2,25 90 bottom
R59  10k  [R0603]  103.4,69.4 0 bottom
R60  10k  [R0603]  108.75,69.46 0 bottom
R61  4k7  [R0603]  36,67 180 bottom
R62  4k7  [R0603]  36,65.2 180 bottom
SG2  BUZZERSMD3  [BUZZER-CMT1102]  27.8,78.4 180 top
TP1  TPB1,27  [B1,27]  33.09,52.12 0 top
TP2  TPB1,27  [B1,27]  34.38,48.99 90 top
TP3  TPB1,27  [B1,27]  35.61,50.46 90 top
TP4  TPB1,27  [B1,27]  27.21,59.8 90 top
TP5  TPB1,27  [B1,27]  34.55,51.49 90 top
TP6  TPB1,27  [B1,27]  68.12,41.69 90 top
TP7  TPB1,27  [B1,27]  56.4,55 90 top
TP8  TPB1,27  [B1,27]  68.27,45.93 90 top
TP9  TPB1,27  [B1,27]  66.54,39.51 90 top
TP10  TPB1,27  [B1,27]  67.43,51.81 90 top
TP11  TPB1,27  [B1,27]  32.76,57.53 90 top
TP12  TPB1,27  [B1,27]  44.25,82.72 90 top
TP13  TPB1,27  [B1,27]  45.48,74.99 90 top
TP14  TPB1,27  [B1,27]  44.25,78.59 90 top
TP15  TPB1,27  [B1,27]  49.33,73.88 90 top
TP16  TPB1,27  [B1,27]  45.8,78.6 90 top
TP17  TPB1,27  [B1,27]  47.66,73.88 90 top
TP18  TPB1,27  [B1,27]  25.63,43.19 90 top
TP19  TPB1,27  [B1,27]  24.86,58.92 0 top
TP20  TPB1,27  [B1,27]  30.51,63.39 0 top
TP21  TPB1,27  [B1,27]  33.3,61.61 0 top
TP22  TPB1,27  [B1,27]  29.5,59.38 0 top
TP23  TPB1,27  [B1,27]  28.76,58.04 0 top
TP24  TPB1,27  [B1,27]  27.21,56.72 0 top
TP25  TPB1,27  [B1,27]  27.3,62.2 0 top
TP26  TPB1,27  [B1,27]  27.09,49.73 0 top
TP27  TPB1,27  [B1,27]  26.44,51.18 0 top
TP28  TPB1,27  [B1,27]  28.6,51.24 0 top
TP29  TPB1,27  [B1,27]  27.98,52.7 0 top
TP30  TPB1,27  [B1,27]  35.48,47.83 0 top
TP31  TPB1,27  [B1,27]  20.83,51.32 0 top
TP32  TPB1,27  [B1,27]  28.45,46.89 0 top
TP33  TPB1,27  [B1,27]  27.71,48.26 0 top
TP34  TPB1,27  [B1,27]  29.91,48.32 0 top
TP35  TPB1,27  [B1,27]  31.94,47.17 0 top
TP36  TPB1,27  [B1,27]  36.52,48.97 0 top
TP37  TPB1,27  [B1,27]  22.38,52.71 0 top
TP38  TPB1,27  [B1,27]  33.59,53.6 0 top
TP39  TPB1,27  [B1,27]  32.69,55.63 90 top
TP40  TPB1,27  [B1,27]  32.1,54.07 90 top
TP41  TPB1,27  [B1,27]  32.33,59.21 90 top
TP42  TPB1,27  [B1,27]  34.9,60.8 90 top
TP43  TPB1,27  [B1,27]  22.98,60.26 90 top
TP44  TPB1,27  [B1,27]  26.39,46.85 0 top
TP45  TPB1,27  [B1,27]  28.15,41.7 0 top
TP46  TPB1,27  [B1,27]  24.97,49.65 0 top
TP47  TPB1,27  [B1,27]  30.53,41.35 0 top
TP48  TPB1,27  [B1,27]  27.08,45.41 0 top
TP49  TPB1,27  [B1,27]  23.07,63.05 0 top
TP50  TPB1,27  [B1,27]  74.8,47.6 0 top
TP51  TPB1,27  [B1,27]  30.56,65.33 0 top
TP52  TPB1,27  [B1,27]  46.16,42.23 0 top
TP53  TPB1,27  [B1,27]  32.3,50.83 0 top
TP54  TPB1,27  [B1,27]  16.8,26.8 0 top
TP55  TPB1,27  [B1,27]  20.4,35.6 0 top
TP56  TPB1,27  [B1,27]  16.7,31.98 0 top
TP57  TPB1,27  [B1,27]  20.36,53.2 0 top
TP58  TPB1,27  [B1,27]  17.46,51.71 0 top
TP59  TPB1,27  [B1,27]  39,64.59 0 top
TP60  TPB1,27  [B1,27]  20.7,54.69 0 top
TP61  TPB1,27  [B1,27]  18.22,54.97 0 top
TP62  TPB1,27  [B1,27]  28.06,54.71 0 top
TP63  TPB1,27  [B1,27]  30.62,54.6 0 top
TP64  TPB1,27  [B1,27]  30.08,56.09 0 top
TP65  TPB1,27  [B1,27]  30.92,57.35 0 top
U1  txb0108  [TSSOP20]  89.46,59.09 0 bottom
U2  L3G4200D  [LGA16-4X4]  57.35,56.83 180 bottom
U$1  DA2032-ALBDA2032-ALB  [DA2032-ALB]  56.6,86.4 0 top
U$2  LM2733  [SOT23-DBV]  69.66,48.92 270 bottom
U$3  TPS54233  [SO8]  14.11,28.67 90 bottom
U$5  MMA7455L  [LGA14]  110.4,77.8 90 bottom
U$6  MMA7455L  [LGA14]  3.4,78 90 bottom
U$100  3,3uH, 5A, EPCOS B82464G4332M , Farnell 7429410  [CR54]  19.98,22.02 270 bottom
U$102  IRF7855PBF  [SO8]  51.14,82.61 270 bottom
VBAT  [3,81/1,4]  52.11,29.2 0 top
X4  USB-A-S  [USB-A-S]  92.46,92.26 270 bottom
X7  SDBMF  [SDBMF-009XXBXX2]  92.4,92.2 180 top
Y2  RESONATORSMD  [RESONATOR-SMD]  18.11,62.52 180 bottom